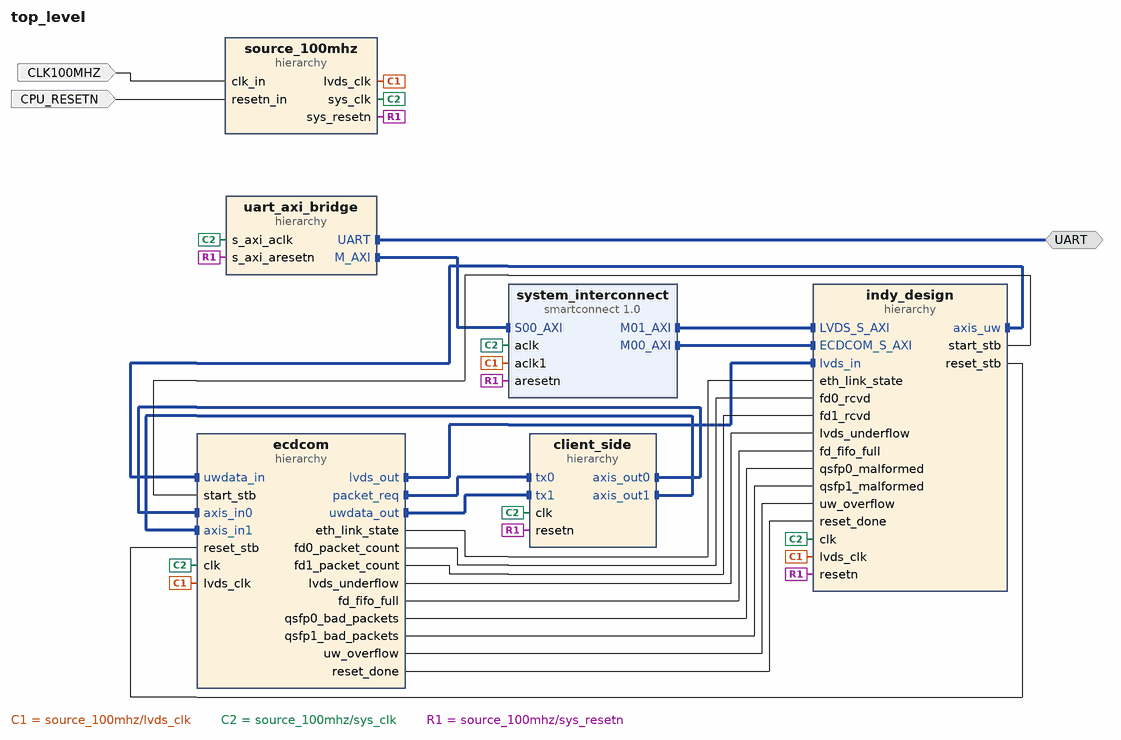
[diagram p0: block diagram of the top level]
# Vivado block design top_level, xc7a100tcsg324-1, Vivado 2024.2
create_bd_design top_level

create_bd_intf_port -mode Master -vlnv xilinx.com:interface:uart_rtl:1.0 UART
create_bd_port -dir I -type clk CLK100MHZ
create_bd_port -dir I -type rst CPU_RESETN

create_bd_cell -type hier source_100mhz
create_bd_cell -type hier uart_axi_bridge
create_bd_cell -type ip -vlnv xilinx.com:ip:smartconnect:1.0 system_interconnect
set_property -dict {CONFIG.NUM_CLKS 2 CONFIG.NUM_MI 2 CONFIG.NUM_SI 1} [get_bd_cells system_interconnect]
create_bd_cell -type hier indy_design
create_bd_cell -type hier ecdcom
create_bd_cell -type hier client_side

# ---- hierarchy /source_100mhz ----
current_bd_instance /source_100mhz
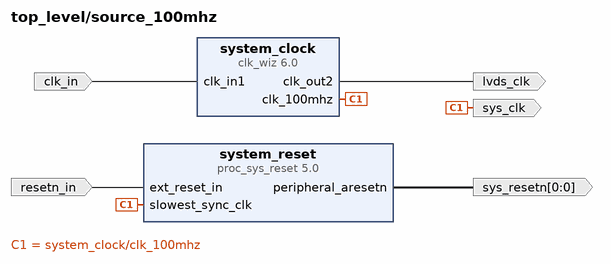
[diagram p1: block diagram inside /source_100mhz]
create_bd_pin -dir I -type clk clk_in
create_bd_pin -dir I -type rst resetn_in
create_bd_pin -dir O -type clk sys_clk
create_bd_pin -dir O -from 0 -to 0 sys_resetn
create_bd_pin -dir O lvds_clk

create_bd_cell -type ip -vlnv xilinx.com:ip:clk_wiz:6.0 system_clock
set_property -dict [list \
  CONFIG.CLKOUT1_JITTER 140.313 \
  CONFIG.CLKOUT1_PHASE_ERROR 94.994 \
  CONFIG.CLKOUT1_REQUESTED_OUT_FREQ 60 \
  CONFIG.CLKOUT2_JITTER 145.943 \
  CONFIG.CLKOUT2_PHASE_ERROR 94.994 \
  CONFIG.CLKOUT2_REQUESTED_OUT_FREQ 50 \
  CONFIG.CLKOUT2_USED true \
  CONFIG.CLK_OUT1_PORT clk_100mhz \
  CONFIG.MMCM_CLKFBOUT_MULT_F 10.500 \
  CONFIG.MMCM_CLKOUT0_DIVIDE_F 17.500 \
  CONFIG.MMCM_CLKOUT1_DIVIDE 21 \
  CONFIG.MMCM_DIVCLK_DIVIDE 1 \
  CONFIG.NUM_OUT_CLKS 2 \
  CONFIG.USE_LOCKED false \
  CONFIG.USE_RESET false \
] [get_bd_cells system_clock]
create_bd_cell -type ip -vlnv xilinx.com:ip:proc_sys_reset:5.0 system_reset

# ---- hierarchy /uart_axi_bridge ----
current_bd_instance /uart_axi_bridge
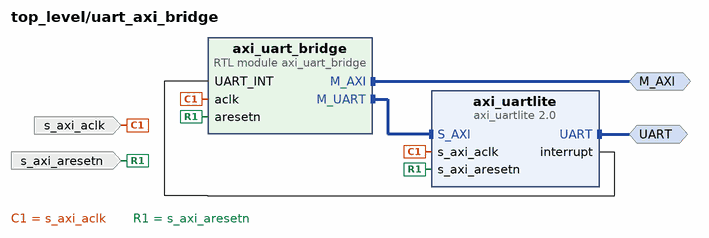
[diagram p2: block diagram inside /uart_axi_bridge]
create_bd_intf_pin -mode Master -vlnv xilinx.com:interface:uart_rtl:1.0 UART
create_bd_intf_pin -mode Master -vlnv xilinx.com:interface:aximm_rtl:1.0 M_AXI
create_bd_pin -dir I -type clk s_axi_aclk
create_bd_pin -dir I -type rst s_axi_aresetn

create_bd_cell -type module -reference axi_uart_bridge axi_uart_bridge
create_bd_cell -type ip -vlnv xilinx.com:ip:axi_uartlite:2.0 axi_uartlite
set_property -dict {CONFIG.C_BAUDRATE 115200} [get_bd_cells axi_uartlite]

# ---- hierarchy /indy_design ----
current_bd_instance /indy_design
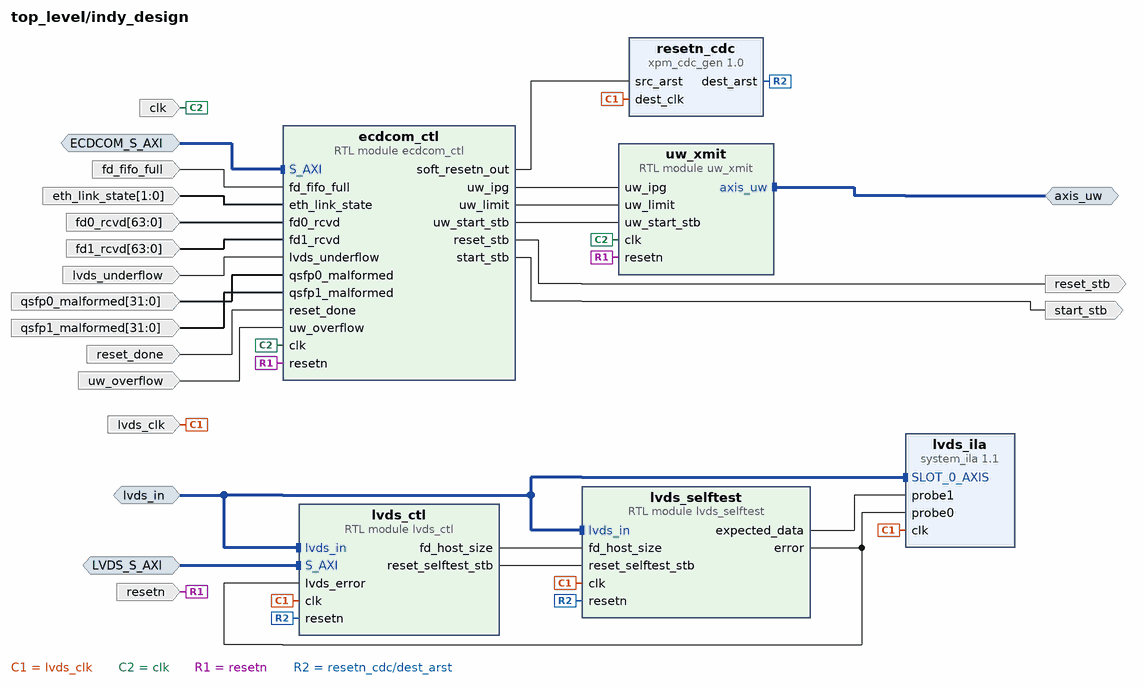
[diagram p3: block diagram inside /indy_design]
create_bd_intf_pin -mode Slave -vlnv xilinx.com:interface:aximm_rtl:1.0 ECDCOM_S_AXI
create_bd_intf_pin -mode Slave -vlnv xilinx.com:interface:aximm_rtl:1.0 LVDS_S_AXI
create_bd_intf_pin -mode Slave -vlnv xilinx.com:interface:axis_rtl:1.0 lvds_in
create_bd_intf_pin -mode Master -vlnv xilinx.com:interface:axis_rtl:1.0 axis_uw
create_bd_pin -dir I -type clk clk
create_bd_pin -dir I -type rst resetn
create_bd_pin -dir O start_stb
create_bd_pin -dir I fd_fifo_full
create_bd_pin -dir I lvds_clk
create_bd_pin -dir I lvds_underflow
create_bd_pin -dir O reset_stb
create_bd_pin -dir I reset_done
create_bd_pin -dir I -from 63 -to 0 fd0_rcvd
create_bd_pin -dir I -from 63 -to 0 fd1_rcvd
create_bd_pin -dir I -from 31 -to 0 qsfp1_malformed
create_bd_pin -dir I -from 31 -to 0 qsfp0_malformed
create_bd_pin -dir I -from 1 -to 0 eth_link_state
create_bd_pin -dir I uw_overflow

create_bd_cell -type module -reference ecdcom_ctl ecdcom_ctl
create_bd_cell -type module -reference lvds_ctl lvds_ctl
create_bd_cell -type ip -vlnv xilinx.com:ip:xpm_cdc_gen:1.0 resetn_cdc
set_property -dict {CONFIG.CDC_TYPE xpm_cdc_async_rst} [get_bd_cells resetn_cdc]
create_bd_cell -type ip -vlnv xilinx.com:ip:system_ila:1.1 lvds_ila
set_property -dict [list \
  CONFIG.C_DATA_DEPTH 1024 \
  CONFIG.C_MON_TYPE MIX \
  CONFIG.C_NUM_OF_PROBES 2 \
  CONFIG.C_SLOT_0_INTF_TYPE xilinx.com:interface:axis_rtl:1.0 \
] [get_bd_cells lvds_ila]
create_bd_cell -type module -reference uw_xmit uw_xmit
create_bd_cell -type module -reference lvds_selftest lvds_selftest

# ---- hierarchy /ecdcom ----
current_bd_instance /ecdcom
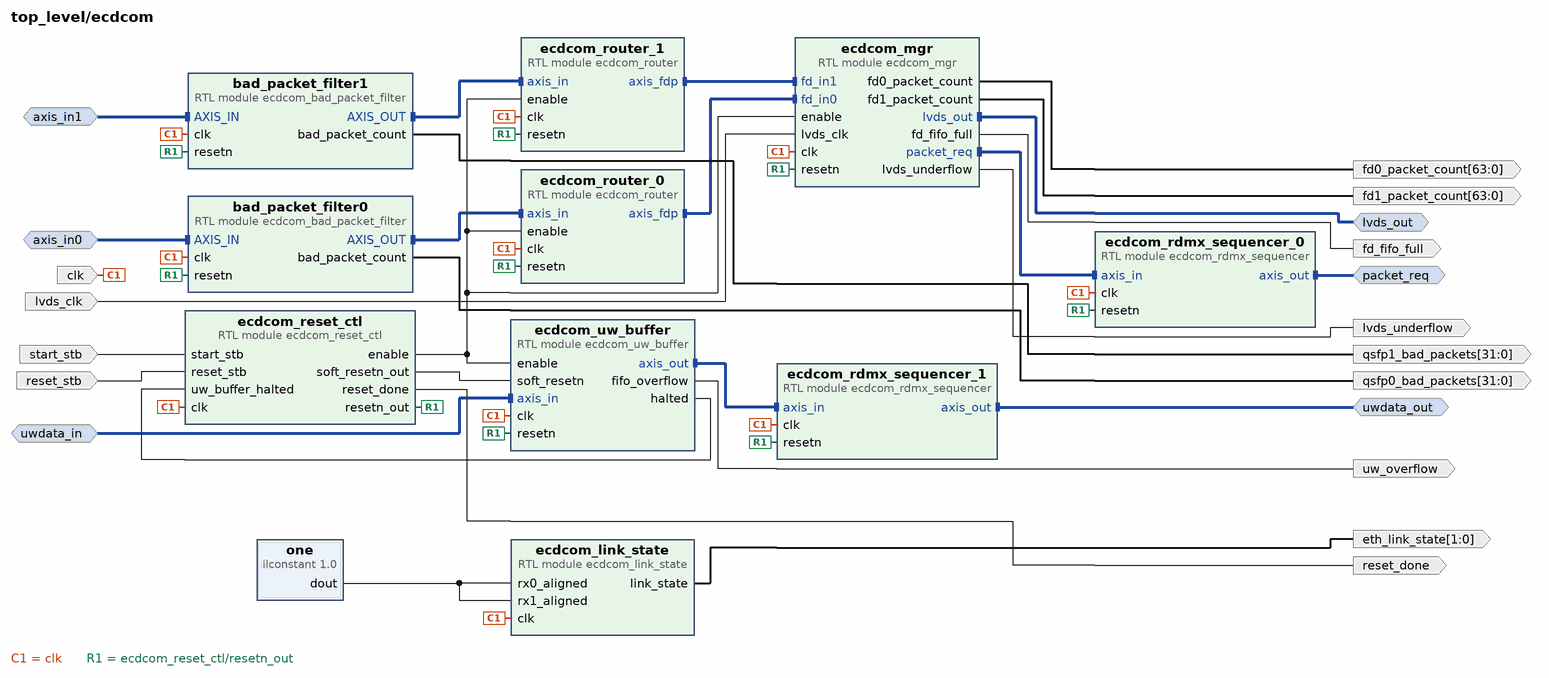
[diagram p4: block diagram inside /ecdcom]
create_bd_intf_pin -mode Slave -vlnv xilinx.com:interface:axis_rtl:1.0 axis_in0
create_bd_intf_pin -mode Slave -vlnv xilinx.com:interface:axis_rtl:1.0 axis_in1
create_bd_intf_pin -mode Master -vlnv xilinx.com:interface:axis_rtl:1.0 packet_req
create_bd_intf_pin -mode Master -vlnv xilinx.com:interface:axis_rtl:1.0 lvds_out
create_bd_intf_pin -mode Slave -vlnv xilinx.com:interface:axis_rtl:1.0 uwdata_in
create_bd_intf_pin -mode Master -vlnv xilinx.com:interface:axis_rtl:1.0 uwdata_out
create_bd_pin -dir I -type clk clk
create_bd_pin -dir I start_stb
create_bd_pin -dir O fd_fifo_full
create_bd_pin -dir I lvds_clk
create_bd_pin -dir O lvds_underflow
create_bd_pin -dir I reset_stb
create_bd_pin -dir O reset_done
create_bd_pin -dir O -from 63 -to 0 fd0_packet_count
create_bd_pin -dir O -from 63 -to 0 fd1_packet_count
create_bd_pin -dir O -from 31 -to 0 qsfp1_bad_packets
create_bd_pin -dir O -from 31 -to 0 qsfp0_bad_packets
create_bd_pin -dir O -from 1 -to 0 eth_link_state
create_bd_pin -dir O uw_overflow

create_bd_cell -type module -reference ecdcom_mgr ecdcom_mgr
create_bd_cell -type module -reference ecdcom_router ecdcom_router_0
create_bd_cell -type module -reference ecdcom_router ecdcom_router_1
create_bd_cell -type module -reference ecdcom_uw_buffer ecdcom_uw_buffer
create_bd_cell -type module -reference ecdcom_rdmx_sequencer ecdcom_rdmx_sequencer_0
create_bd_cell -type module -reference ecdcom_rdmx_sequencer ecdcom_rdmx_sequencer_1
create_bd_cell -type module -reference ecdcom_bad_packet_filter bad_packet_filter0
create_bd_cell -type module -reference ecdcom_bad_packet_filter bad_packet_filter1
create_bd_cell -type module -reference ecdcom_link_state ecdcom_link_state
create_bd_cell -type inline_hdl -vlnv xilinx.com:inline_hdl:ilconstant:1.0 one
create_bd_cell -type module -reference ecdcom_reset_ctl ecdcom_reset_ctl

# ---- hierarchy /client_side ----
current_bd_instance /client_side
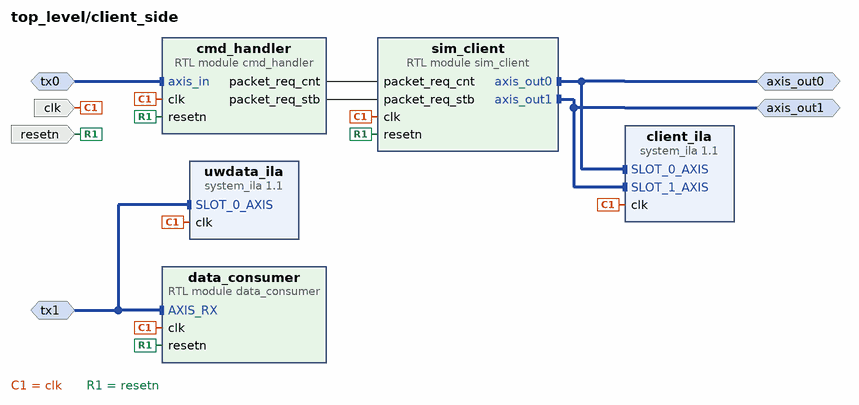
[diagram p5: block diagram inside /client_side]
create_bd_intf_pin -mode Master -vlnv xilinx.com:interface:axis_rtl:1.0 axis_out0
create_bd_intf_pin -mode Master -vlnv xilinx.com:interface:axis_rtl:1.0 axis_out1
create_bd_intf_pin -mode Slave -vlnv xilinx.com:interface:axis_rtl:1.0 tx0
create_bd_intf_pin -mode Slave -vlnv xilinx.com:interface:axis_rtl:1.0 tx1
create_bd_pin -dir I -type clk clk
create_bd_pin -dir I -type rst resetn

create_bd_cell -type module -reference sim_client sim_client
create_bd_cell -type module -reference cmd_handler cmd_handler
create_bd_cell -type module -reference data_consumer data_consumer
set_property -dict {CONFIG.NREADY_CYCLES 3 CONFIG.READY_CYCLES 8} [get_bd_cells data_consumer]
create_bd_cell -type ip -vlnv xilinx.com:ip:system_ila:1.1 uwdata_ila
set_property -dict {CONFIG.C_SLOT_0_INTF_TYPE xilinx.com:interface:axis_rtl:1.0} [get_bd_cells uwdata_ila]
create_bd_cell -type ip -vlnv xilinx.com:ip:system_ila:1.1 client_ila
set_property -dict [list \
  CONFIG.C_NUM_MONITOR_SLOTS 2 \
  CONFIG.C_SLOT 1 \
  CONFIG.C_SLOT_0_INTF_TYPE xilinx.com:interface:axis_rtl:1.0 \
  CONFIG.C_SLOT_1_INTF_TYPE xilinx.com:interface:axis_rtl:1.0 \
] [get_bd_cells client_ila]

# ---- connections ----

current_bd_instance /source_100mhz
connect_bd_net -net clk_in1_0_1 [get_bd_pins clk_in] [get_bd_pins system_clock/clk_in1]
connect_bd_net -net ext_reset_in_0_1 [get_bd_pins resetn_in] [get_bd_pins system_reset/ext_reset_in]
connect_bd_net [get_bd_pins system_clock/clk_100mhz] [get_bd_pins sys_clk] [get_bd_pins system_reset/slowest_sync_clk]
connect_bd_net [get_bd_pins system_clock/clk_out2] [get_bd_pins lvds_clk]
connect_bd_net [get_bd_pins system_reset/peripheral_aresetn] [get_bd_pins sys_resetn]

current_bd_instance /uart_axi_bridge
connect_bd_intf_net [get_bd_intf_pins M_AXI] [get_bd_intf_pins axi_uart_bridge/M_AXI]
connect_bd_intf_net [get_bd_intf_pins axi_uart_bridge/M_UART] [get_bd_intf_pins axi_uartlite/S_AXI]
connect_bd_intf_net [get_bd_intf_pins UART] [get_bd_intf_pins axi_uartlite/UART]
connect_bd_net [get_bd_pins axi_uartlite/interrupt] [get_bd_pins axi_uart_bridge/UART_INT]
connect_bd_net -net source_100mhz_sys_clk [get_bd_pins s_axi_aclk] [get_bd_pins axi_uart_bridge/aclk] [get_bd_pins axi_uartlite/s_axi_aclk]
connect_bd_net -net source_100mhz_sys_resetn [get_bd_pins s_axi_aresetn] \
  [get_bd_pins axi_uart_bridge/aresetn] [get_bd_pins axi_uartlite/s_axi_aresetn]

current_bd_instance /indy_design
connect_bd_intf_net [get_bd_intf_pins LVDS_S_AXI] [get_bd_intf_pins lvds_ctl/S_AXI]
connect_bd_intf_net [get_bd_intf_pins lvds_in] [get_bd_intf_pins lvds_ctl/lvds_in]
connect_bd_intf_net [get_bd_intf_pins lvds_in] [get_bd_intf_pins lvds_ila/SLOT_0_AXIS]
connect_bd_intf_net [get_bd_intf_pins lvds_in] [get_bd_intf_pins lvds_selftest/lvds_in]
connect_bd_intf_net -intf_net system_interconnect_M00_AXI [get_bd_intf_pins ECDCOM_S_AXI] [get_bd_intf_pins ecdcom_ctl/S_AXI]
connect_bd_intf_net -intf_net uw_xmit_0_axis_uw [get_bd_intf_pins axis_uw] [get_bd_intf_pins uw_xmit/axis_uw]
connect_bd_net [get_bd_pins ecdcom_ctl/reset_stb] [get_bd_pins reset_stb]
connect_bd_net [get_bd_pins ecdcom_ctl/soft_resetn_out] [get_bd_pins resetn_cdc/src_arst]
connect_bd_net [get_bd_pins ecdcom_ctl/start_stb] [get_bd_pins start_stb]
connect_bd_net [get_bd_pins ecdcom_ctl/uw_ipg] [get_bd_pins uw_xmit/uw_ipg]
connect_bd_net [get_bd_pins ecdcom_ctl/uw_limit] [get_bd_pins uw_xmit/uw_limit]
connect_bd_net [get_bd_pins ecdcom_ctl/uw_start_stb] [get_bd_pins uw_xmit/uw_start_stb]
connect_bd_net -net ecdcom_mgr_fd_fifo_full [get_bd_pins fd_fifo_full] [get_bd_pins ecdcom_ctl/fd_fifo_full]
connect_bd_net [get_bd_pins eth_link_state] [get_bd_pins ecdcom_ctl/eth_link_state]
connect_bd_net [get_bd_pins fd0_rcvd] [get_bd_pins ecdcom_ctl/fd0_rcvd]
connect_bd_net [get_bd_pins fd1_rcvd] [get_bd_pins ecdcom_ctl/fd1_rcvd]
connect_bd_net [get_bd_pins lvds_clk] \
  [get_bd_pins resetn_cdc/dest_clk] [get_bd_pins lvds_ila/clk] [get_bd_pins lvds_selftest/clk] [get_bd_pins lvds_ctl/clk]
connect_bd_net [get_bd_pins lvds_ctl/fd_host_size] [get_bd_pins lvds_selftest/fd_host_size]
connect_bd_net [get_bd_pins lvds_ctl/reset_selftest_stb] [get_bd_pins lvds_selftest/reset_selftest_stb]
connect_bd_net [get_bd_pins lvds_selftest/error] [get_bd_pins lvds_ila/probe0] [get_bd_pins lvds_ctl/lvds_error]
connect_bd_net [get_bd_pins lvds_selftest/expected_data] [get_bd_pins lvds_ila/probe1]
connect_bd_net [get_bd_pins lvds_underflow] [get_bd_pins ecdcom_ctl/lvds_underflow]
connect_bd_net [get_bd_pins qsfp0_malformed] [get_bd_pins ecdcom_ctl/qsfp0_malformed]
connect_bd_net [get_bd_pins qsfp1_malformed] [get_bd_pins ecdcom_ctl/qsfp1_malformed]
connect_bd_net [get_bd_pins reset_done] [get_bd_pins ecdcom_ctl/reset_done]
connect_bd_net -net source_100mhz_sys_clk [get_bd_pins clk] [get_bd_pins uw_xmit/clk] [get_bd_pins ecdcom_ctl/clk]
connect_bd_net -net source_100mhz_sys_resetn [get_bd_pins resetn] [get_bd_pins uw_xmit/resetn] [get_bd_pins ecdcom_ctl/resetn]
connect_bd_net [get_bd_pins uw_overflow] [get_bd_pins ecdcom_ctl/uw_overflow]
connect_bd_net -net xpm_cdc_gen_0_dest_arst [get_bd_pins resetn_cdc/dest_arst] [get_bd_pins lvds_selftest/resetn] [get_bd_pins lvds_ctl/resetn]

current_bd_instance /ecdcom
connect_bd_intf_net -intf_net axis_in0_1 [get_bd_intf_pins axis_in0] [get_bd_intf_pins bad_packet_filter0/AXIS_IN]
connect_bd_intf_net -intf_net axis_in1_1 [get_bd_intf_pins axis_in1] [get_bd_intf_pins bad_packet_filter1/AXIS_IN]
connect_bd_intf_net [get_bd_intf_pins bad_packet_filter0/AXIS_OUT] [get_bd_intf_pins ecdcom_router_0/axis_in]
connect_bd_intf_net [get_bd_intf_pins bad_packet_filter1/AXIS_OUT] [get_bd_intf_pins ecdcom_router_1/axis_in]
connect_bd_intf_net [get_bd_intf_pins lvds_out] [get_bd_intf_pins ecdcom_mgr/lvds_out]
connect_bd_intf_net [get_bd_intf_pins ecdcom_mgr/packet_req] [get_bd_intf_pins ecdcom_rdmx_sequencer_0/axis_in]
connect_bd_intf_net [get_bd_intf_pins packet_req] [get_bd_intf_pins ecdcom_rdmx_sequencer_0/axis_out]
connect_bd_intf_net [get_bd_intf_pins uwdata_out] [get_bd_intf_pins ecdcom_rdmx_sequencer_1/axis_out]
connect_bd_intf_net [get_bd_intf_pins ecdcom_router_0/axis_fdp] [get_bd_intf_pins ecdcom_mgr/fd_in0]
connect_bd_intf_net [get_bd_intf_pins ecdcom_router_1/axis_fdp] [get_bd_intf_pins ecdcom_mgr/fd_in1]
connect_bd_intf_net [get_bd_intf_pins ecdcom_rdmx_sequencer_1/axis_in] [get_bd_intf_pins ecdcom_uw_buffer/axis_out]
connect_bd_intf_net [get_bd_intf_pins uwdata_in] [get_bd_intf_pins ecdcom_uw_buffer/axis_in]
connect_bd_net [get_bd_pins lvds_clk] [get_bd_pins ecdcom_mgr/lvds_clk]
connect_bd_net [get_bd_pins bad_packet_filter0/bad_packet_count] [get_bd_pins qsfp0_bad_packets]
connect_bd_net [get_bd_pins bad_packet_filter1/bad_packet_count] [get_bd_pins qsfp1_bad_packets]
connect_bd_net -net ecdcom_ctl_start_stb [get_bd_pins start_stb] [get_bd_pins ecdcom_reset_ctl/start_stb]
connect_bd_net [get_bd_pins ecdcom_link_state/link_state] [get_bd_pins eth_link_state]
connect_bd_net [get_bd_pins ecdcom_mgr/fd0_packet_count] [get_bd_pins fd0_packet_count]
connect_bd_net [get_bd_pins ecdcom_mgr/fd1_packet_count] [get_bd_pins fd1_packet_count]
connect_bd_net [get_bd_pins ecdcom_mgr/fd_fifo_full] [get_bd_pins fd_fifo_full]
connect_bd_net [get_bd_pins ecdcom_mgr/lvds_underflow] [get_bd_pins lvds_underflow]
connect_bd_net -net ecdcom_reset_ctl_0_reset_done [get_bd_pins ecdcom_reset_ctl/reset_done] [get_bd_pins reset_done]
connect_bd_net [get_bd_pins ecdcom_reset_ctl/enable] \
  [get_bd_pins ecdcom_uw_buffer/enable] [get_bd_pins ecdcom_router_1/enable] [get_bd_pins ecdcom_router_0/enable] \
  [get_bd_pins ecdcom_mgr/enable]
connect_bd_net [get_bd_pins ecdcom_reset_ctl/soft_resetn_out] [get_bd_pins ecdcom_uw_buffer/soft_resetn]
connect_bd_net [get_bd_pins ecdcom_uw_buffer/fifo_overflow] [get_bd_pins uw_overflow]
connect_bd_net [get_bd_pins ecdcom_uw_buffer/halted] [get_bd_pins ecdcom_reset_ctl/uw_buffer_halted]
connect_bd_net [get_bd_pins one/dout] [get_bd_pins ecdcom_link_state/rx0_aligned] [get_bd_pins ecdcom_link_state/rx1_aligned]
connect_bd_net [get_bd_pins reset_stb] [get_bd_pins ecdcom_reset_ctl/reset_stb]
connect_bd_net -net source_100mhz_sys_clk [get_bd_pins clk] \
  [get_bd_pins ecdcom_router_1/clk] [get_bd_pins ecdcom_rdmx_sequencer_0/clk] [get_bd_pins ecdcom_rdmx_sequencer_1/clk] \
  [get_bd_pins bad_packet_filter0/clk] [get_bd_pins bad_packet_filter1/clk] [get_bd_pins ecdcom_link_state/clk] \
  [get_bd_pins ecdcom_router_0/clk] [get_bd_pins ecdcom_mgr/clk] [get_bd_pins ecdcom_reset_ctl/clk] \
  [get_bd_pins ecdcom_uw_buffer/clk]
connect_bd_net -net source_100mhz_sys_resetn [get_bd_pins ecdcom_reset_ctl/resetn_out] \
  [get_bd_pins ecdcom_router_1/resetn] [get_bd_pins ecdcom_rdmx_sequencer_0/resetn] \
  [get_bd_pins ecdcom_rdmx_sequencer_1/resetn] [get_bd_pins bad_packet_filter1/resetn] \
  [get_bd_pins bad_packet_filter0/resetn] [get_bd_pins ecdcom_router_0/resetn] [get_bd_pins ecdcom_mgr/resetn] \
  [get_bd_pins ecdcom_uw_buffer/resetn]

current_bd_instance /client_side
connect_bd_intf_net -intf_net ecdcom_mgr_packet_req [get_bd_intf_pins tx0] [get_bd_intf_pins cmd_handler/axis_in]
connect_bd_intf_net [get_bd_intf_pins axis_out0] [get_bd_intf_pins sim_client/axis_out0]
connect_bd_intf_net [get_bd_intf_pins axis_out0] [get_bd_intf_pins client_ila/SLOT_0_AXIS]
connect_bd_intf_net [get_bd_intf_pins axis_out1] [get_bd_intf_pins sim_client/axis_out1]
connect_bd_intf_net [get_bd_intf_pins axis_out1] [get_bd_intf_pins client_ila/SLOT_1_AXIS]
connect_bd_intf_net -intf_net tx1_1 [get_bd_intf_pins tx1] [get_bd_intf_pins data_consumer/AXIS_RX]
connect_bd_intf_net [get_bd_intf_pins tx1] [get_bd_intf_pins uwdata_ila/SLOT_0_AXIS]
connect_bd_net -net cmd_handler_0_packet_req_cnt [get_bd_pins cmd_handler/packet_req_cnt] [get_bd_pins sim_client/packet_req_cnt]
connect_bd_net -net cmd_handler_0_packet_req_stb [get_bd_pins cmd_handler/packet_req_stb] [get_bd_pins sim_client/packet_req_stb]
connect_bd_net -net source_100mhz_sys_clk [get_bd_pins clk] \
  [get_bd_pins cmd_handler/clk] [get_bd_pins data_consumer/clk] [get_bd_pins uwdata_ila/clk] [get_bd_pins client_ila/clk] \
  [get_bd_pins sim_client/clk]
connect_bd_net -net source_100mhz_sys_resetn [get_bd_pins resetn] \
  [get_bd_pins cmd_handler/resetn] [get_bd_pins data_consumer/resetn] [get_bd_pins sim_client/resetn]

current_bd_instance /
connect_bd_intf_net [get_bd_intf_pins indy_design/LVDS_S_AXI] [get_bd_intf_pins system_interconnect/M01_AXI]
connect_bd_intf_net -intf_net axi_uartlite_UART [get_bd_intf_ports UART] [get_bd_intf_pins uart_axi_bridge/UART]
connect_bd_intf_net -intf_net ecdcom_mgr_packet_req [get_bd_intf_pins ecdcom/packet_req] [get_bd_intf_pins client_side/tx0]
connect_bd_intf_net [get_bd_intf_pins ecdcom/uwdata_out] [get_bd_intf_pins client_side/tx1]
connect_bd_intf_net [get_bd_intf_pins indy_design/axis_uw] [get_bd_intf_pins ecdcom/uwdata_in]
connect_bd_intf_net [get_bd_intf_pins indy_design/lvds_in] [get_bd_intf_pins ecdcom/lvds_out]
connect_bd_intf_net -intf_net sim_client_axis_out0 [get_bd_intf_pins ecdcom/axis_in0] [get_bd_intf_pins client_side/axis_out0]
connect_bd_intf_net -intf_net sim_client_axis_out1 [get_bd_intf_pins ecdcom/axis_in1] [get_bd_intf_pins client_side/axis_out1]
connect_bd_intf_net [get_bd_intf_pins indy_design/ECDCOM_S_AXI] [get_bd_intf_pins system_interconnect/M00_AXI]
connect_bd_intf_net [get_bd_intf_pins uart_axi_bridge/M_AXI] [get_bd_intf_pins system_interconnect/S00_AXI]
connect_bd_net [get_bd_pins source_100mhz/lvds_clk] \
  [get_bd_pins ecdcom/lvds_clk] [get_bd_pins system_interconnect/aclk1] [get_bd_pins indy_design/lvds_clk]
connect_bd_net -net clk_in1_0_1 [get_bd_ports CLK100MHZ] [get_bd_pins source_100mhz/clk_in]
connect_bd_net -net ecdcom_ctl_start_stb [get_bd_pins indy_design/start_stb] [get_bd_pins ecdcom/start_stb]
connect_bd_net [get_bd_pins ecdcom/eth_link_state] [get_bd_pins indy_design/eth_link_state]
connect_bd_net [get_bd_pins ecdcom/fd0_packet_count] [get_bd_pins indy_design/fd0_rcvd]
connect_bd_net [get_bd_pins ecdcom/fd1_packet_count] [get_bd_pins indy_design/fd1_rcvd]
connect_bd_net [get_bd_pins ecdcom/lvds_underflow] [get_bd_pins indy_design/lvds_underflow]
connect_bd_net -net ecdcom_mgr_fd_fifo_full [get_bd_pins ecdcom/fd_fifo_full] [get_bd_pins indy_design/fd_fifo_full]
connect_bd_net [get_bd_pins ecdcom/qsfp0_bad_packets] [get_bd_pins indy_design/qsfp0_malformed]
connect_bd_net [get_bd_pins ecdcom/qsfp1_bad_packets] [get_bd_pins indy_design/qsfp1_malformed]
connect_bd_net [get_bd_pins ecdcom/uw_overflow] [get_bd_pins indy_design/uw_overflow]
connect_bd_net -net ext_reset_in_0_1 [get_bd_ports CPU_RESETN] [get_bd_pins source_100mhz/resetn_in]
connect_bd_net [get_bd_pins indy_design/reset_stb] [get_bd_pins ecdcom/reset_stb]
connect_bd_net -net reset_done_1 [get_bd_pins ecdcom/reset_done] [get_bd_pins indy_design/reset_done]
connect_bd_net [get_bd_pins source_100mhz/sys_clk] \
  [get_bd_pins uart_axi_bridge/s_axi_aclk] [get_bd_pins system_interconnect/aclk] [get_bd_pins indy_design/clk] \
  [get_bd_pins ecdcom/clk] [get_bd_pins client_side/clk]
connect_bd_net [get_bd_pins source_100mhz/sys_resetn] \
  [get_bd_pins uart_axi_bridge/s_axi_aresetn] [get_bd_pins system_interconnect/aresetn] [get_bd_pins indy_design/resetn] \
  [get_bd_pins client_side/resetn]

# ---- address map ----
assign_bd_address -offset 0x0000000000001000 -range 4K -target_address_space [get_bd_addr_spaces uart_axi_bridge/axi_uart_bridge/M_AXI] [get_bd_addr_segs indy_design/ecdcom_ctl/S_AXI/reg0]
assign_bd_address -offset 0x0000000000002000 -range 4K -target_address_space [get_bd_addr_spaces uart_axi_bridge/axi_uart_bridge/M_AXI] [get_bd_addr_segs indy_design/lvds_ctl/S_AXI/reg0]
assign_bd_address -offset 0x40600000 -range 64K -target_address_space [get_bd_addr_spaces uart_axi_bridge/axi_uart_bridge/M_UART] [get_bd_addr_segs uart_axi_bridge/axi_uartlite/S_AXI/Reg]

validate_bd_design
save_bd_design
